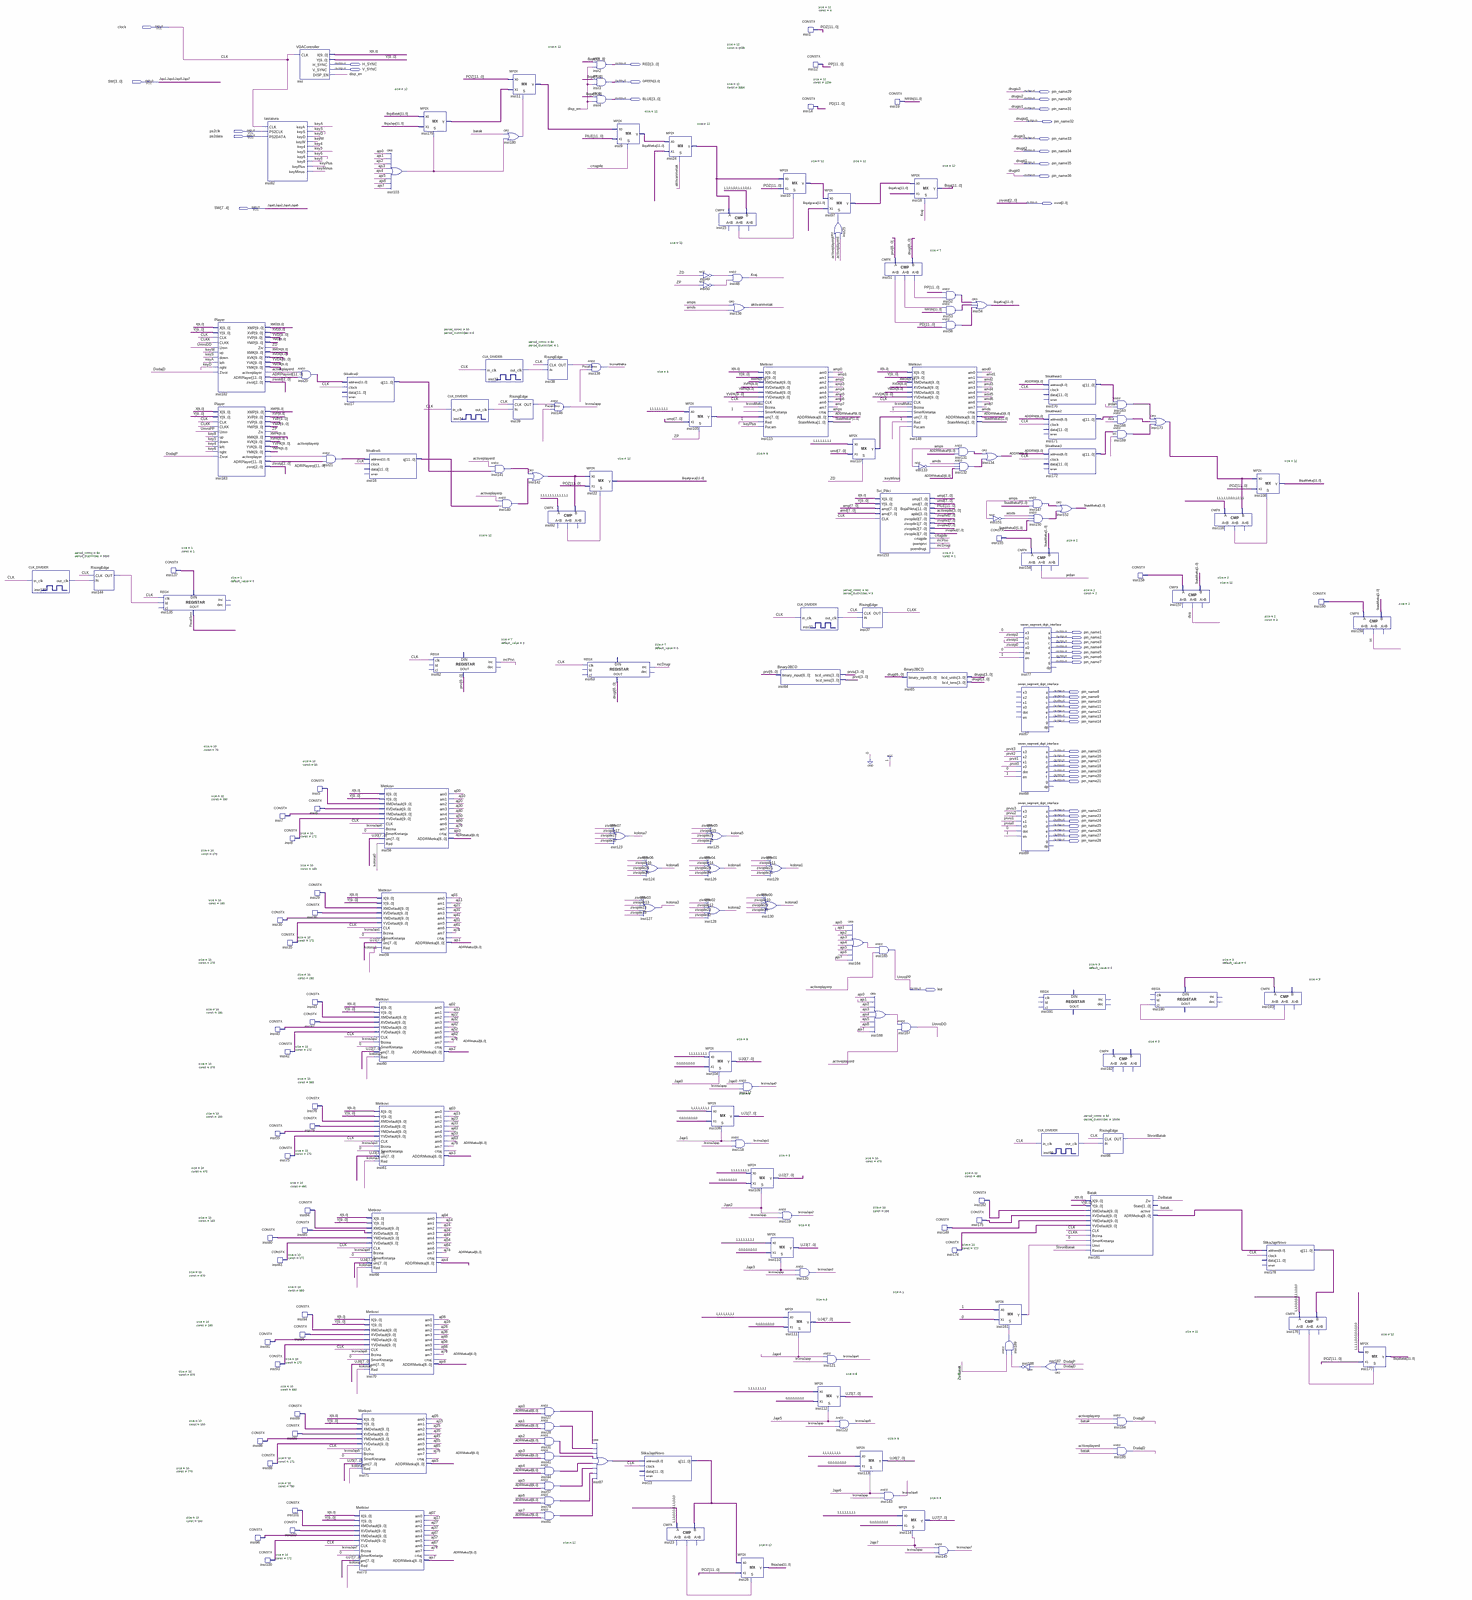
[diagram p0: schematic sheet, whole]
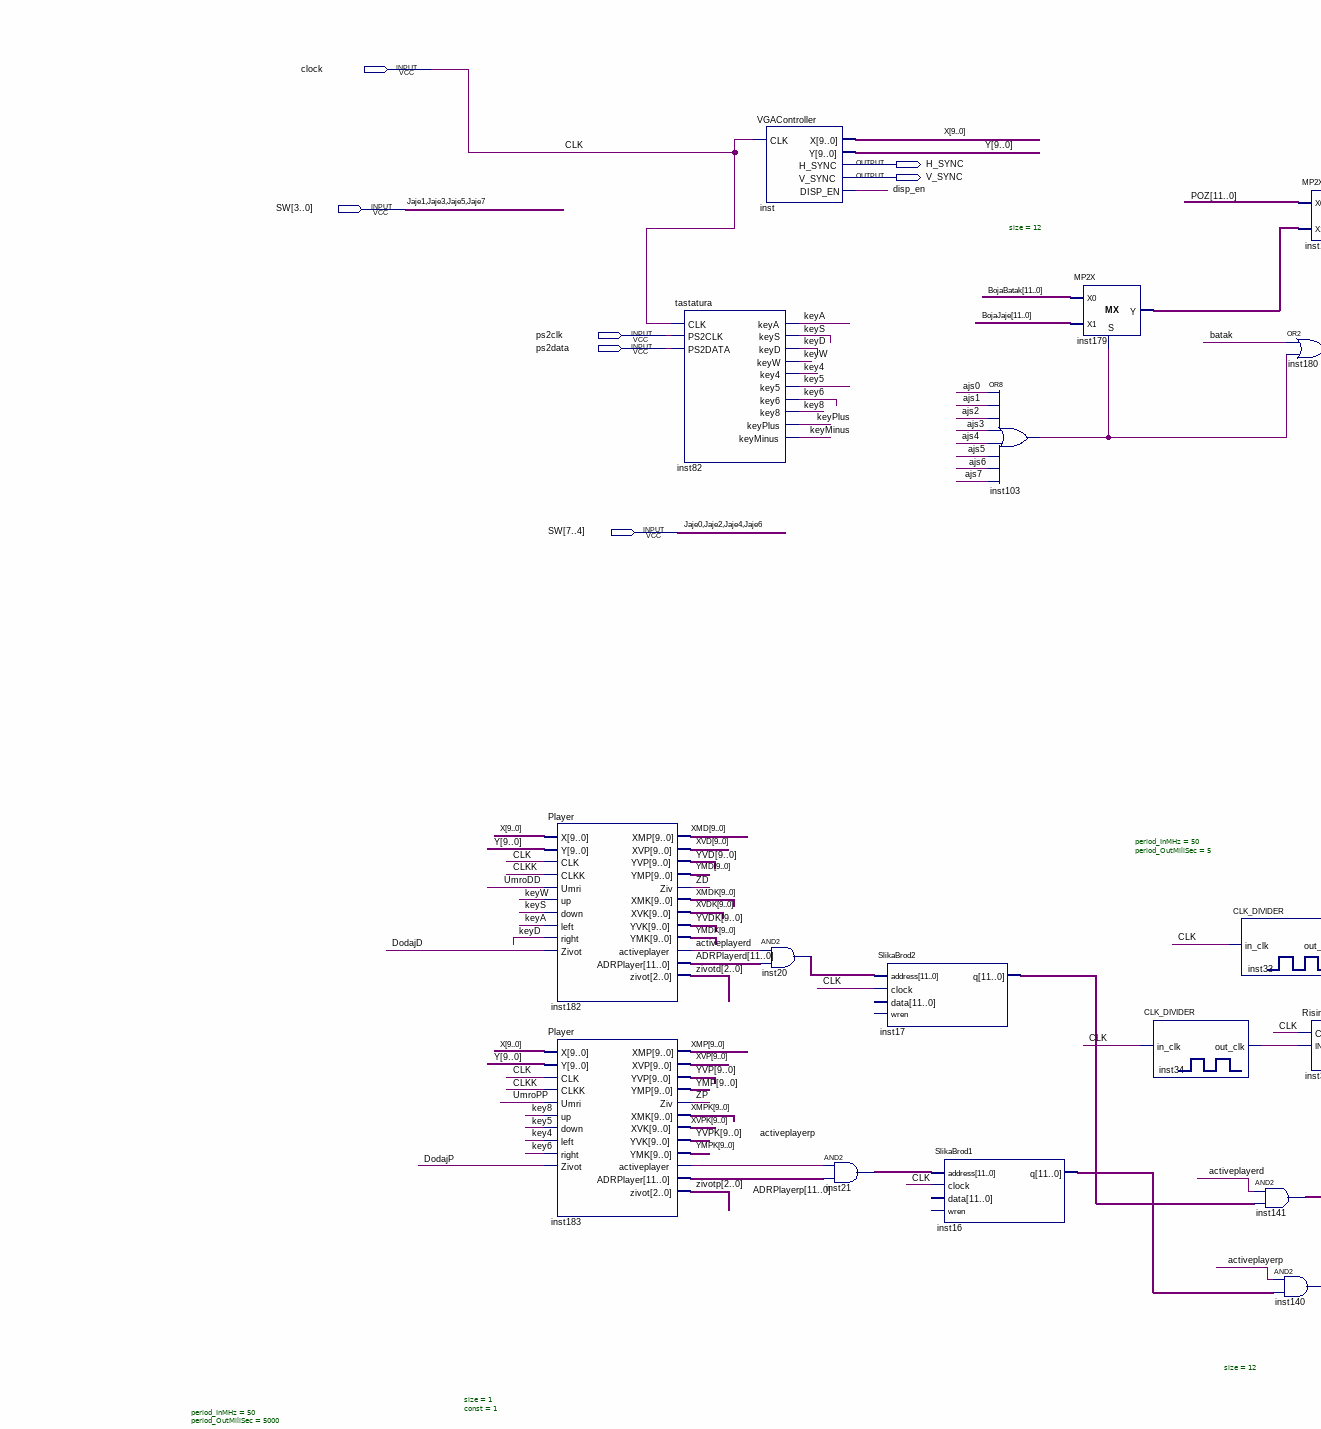
[diagram p1: schematic sheet, upper left part]
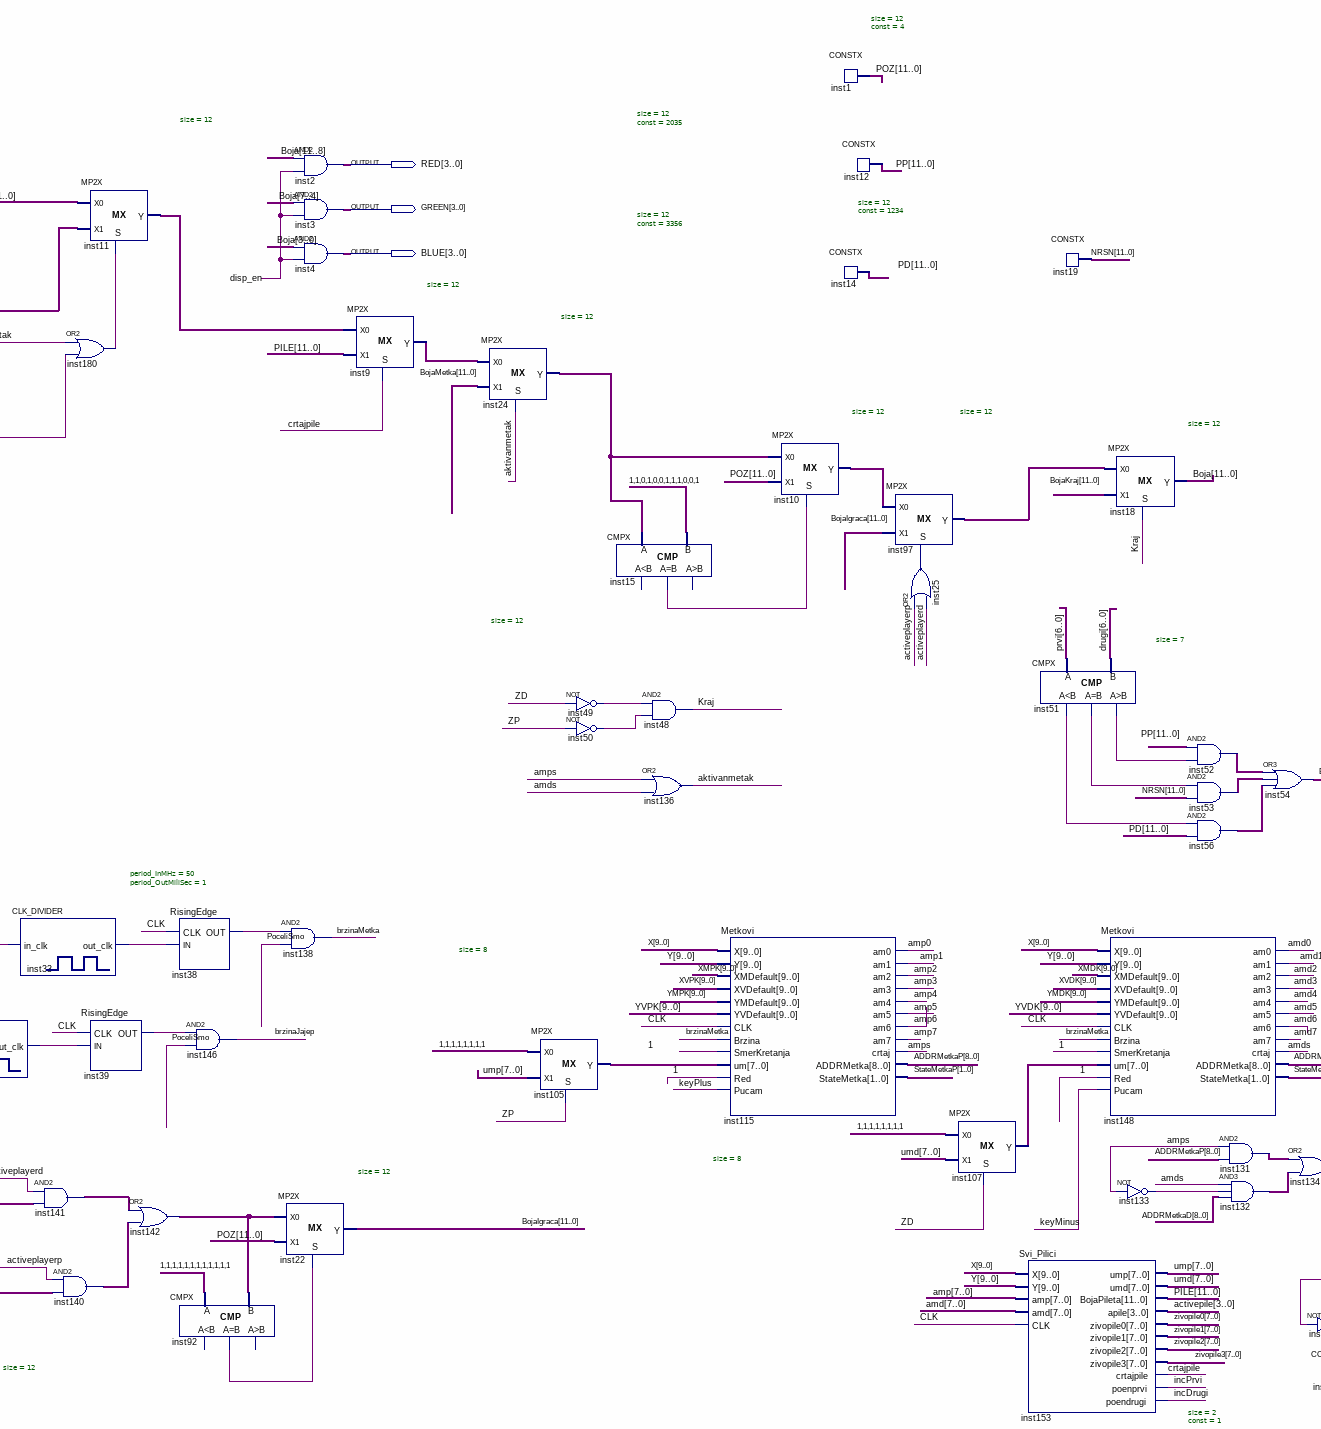
[diagram p2: schematic sheet, upper centre part]
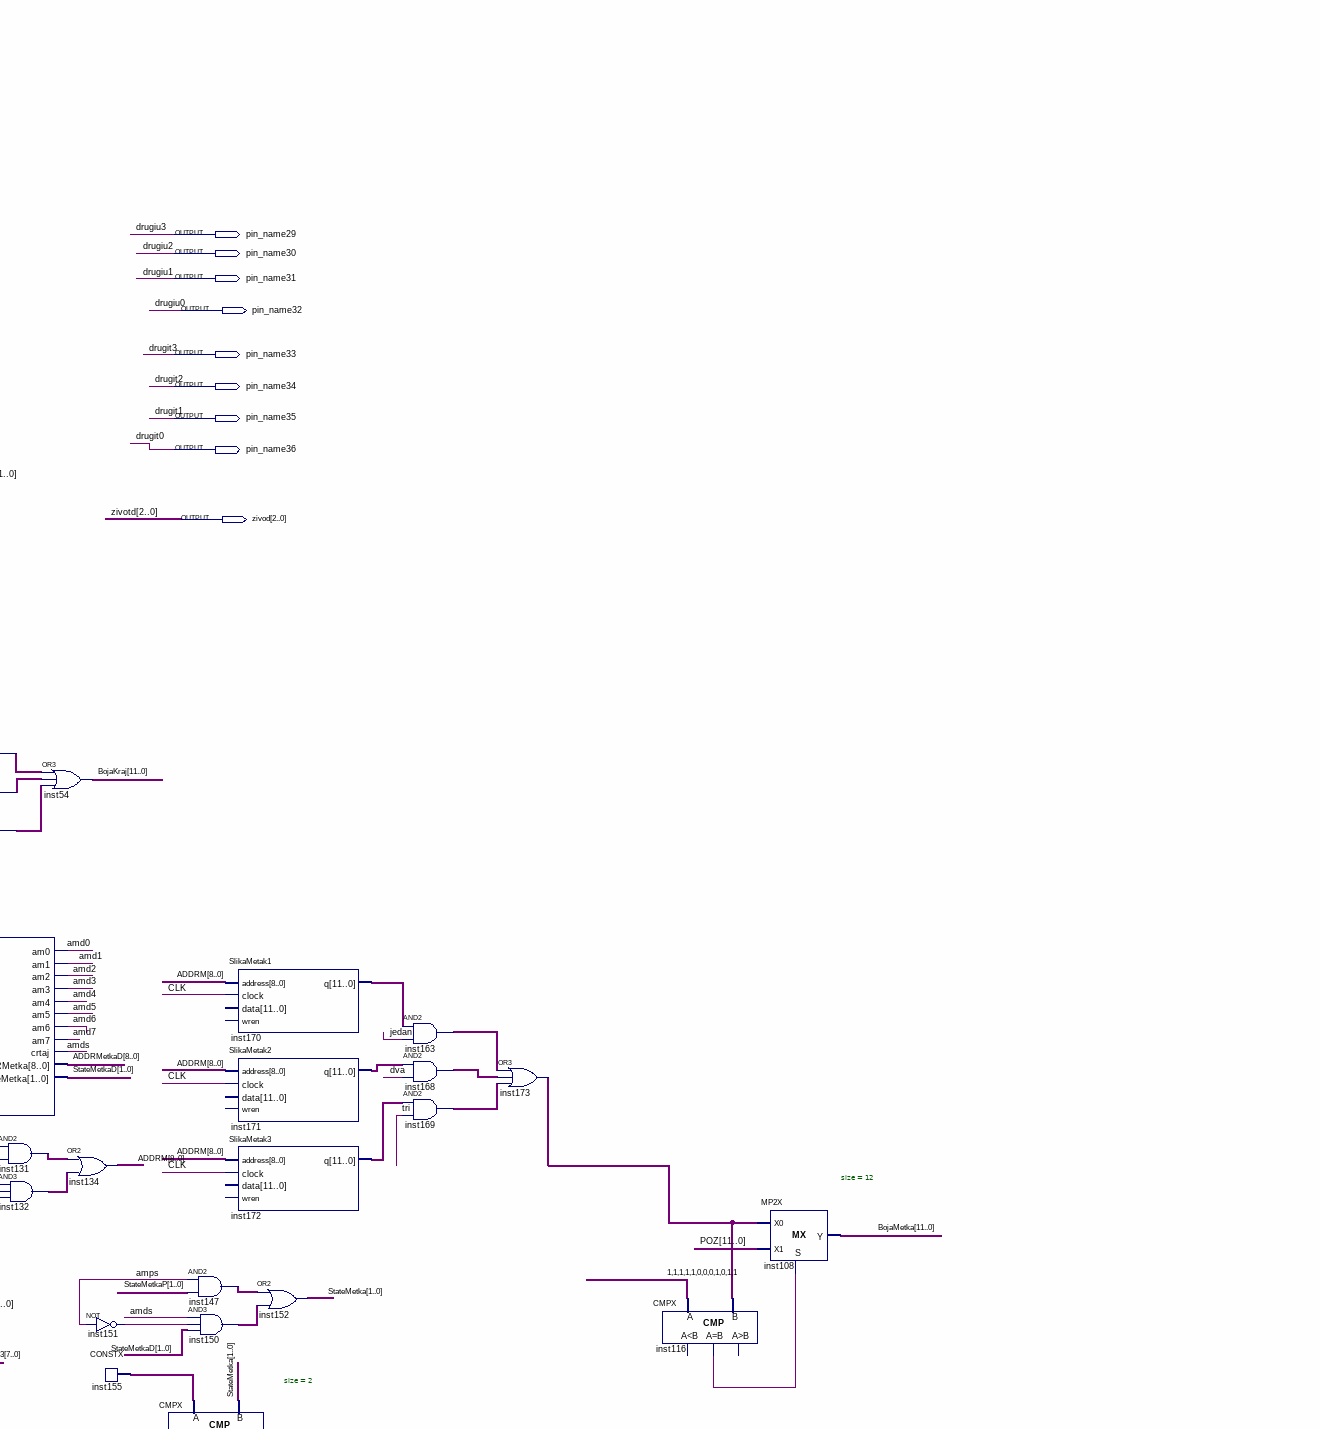
[diagram p3: schematic sheet, upper right part]
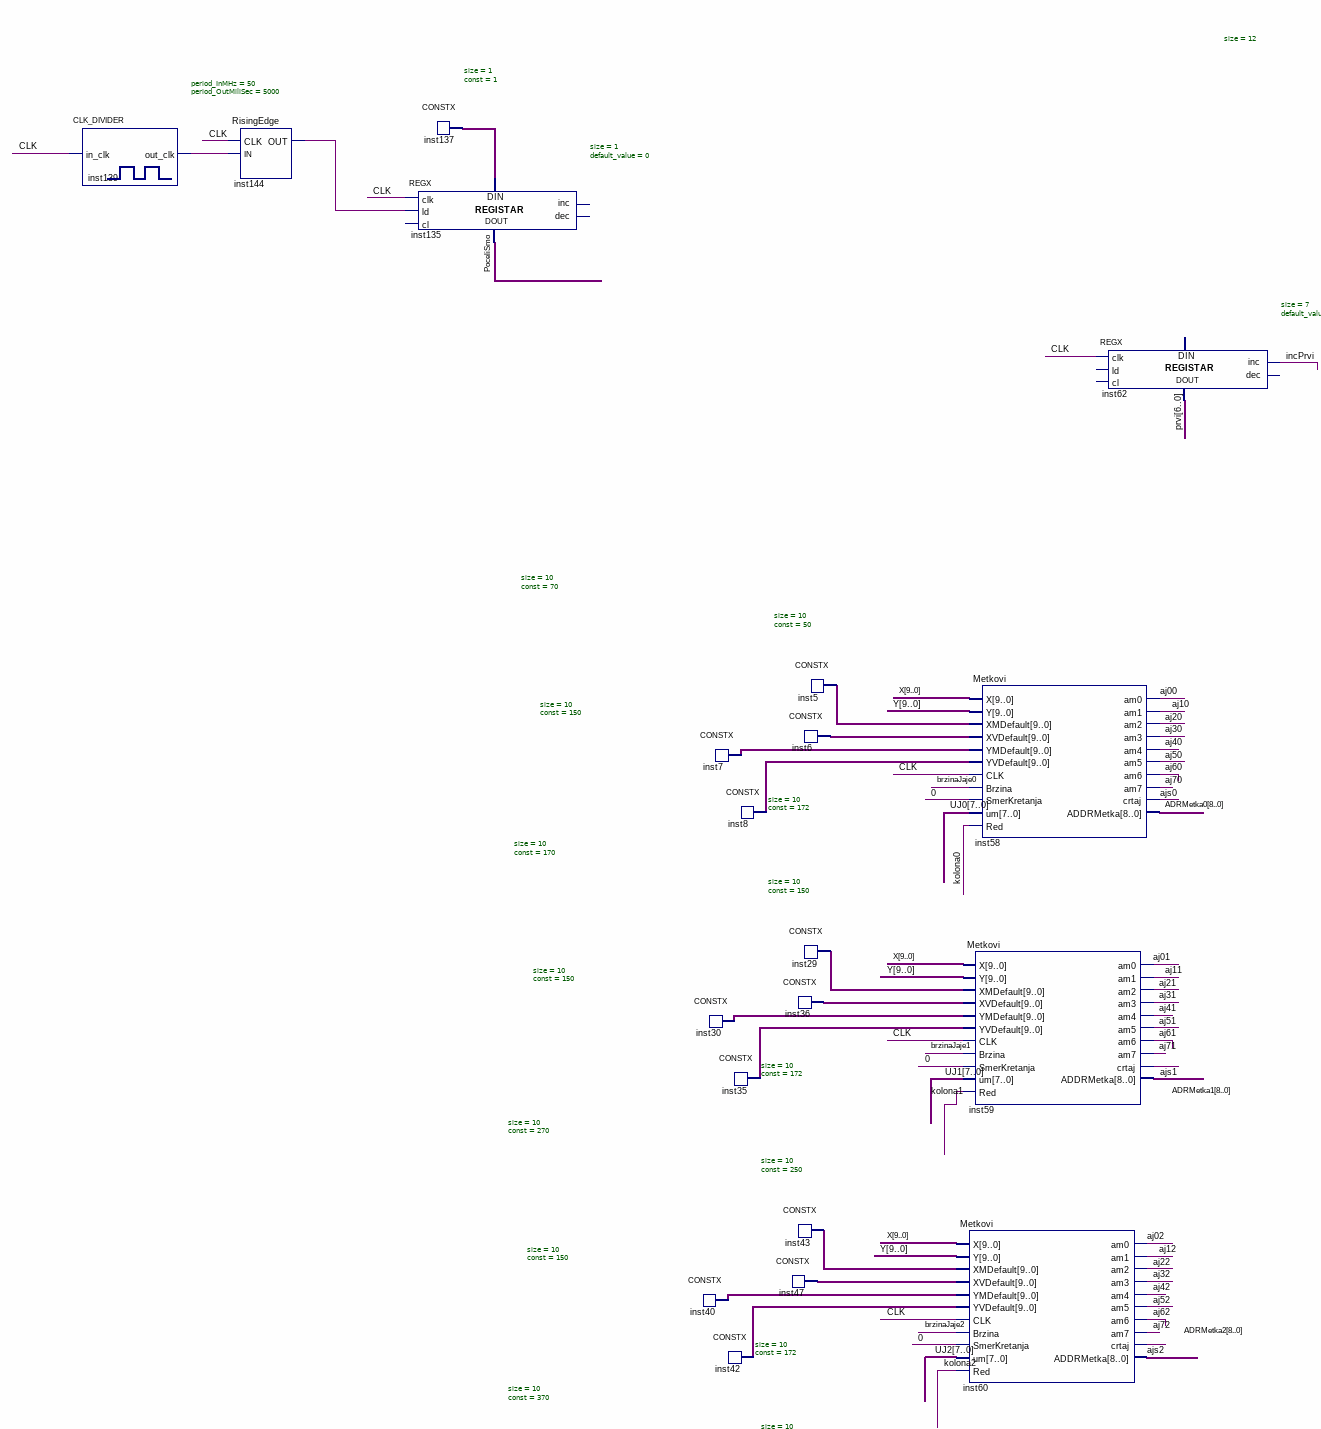
[diagram p4: schematic sheet, middle left part]
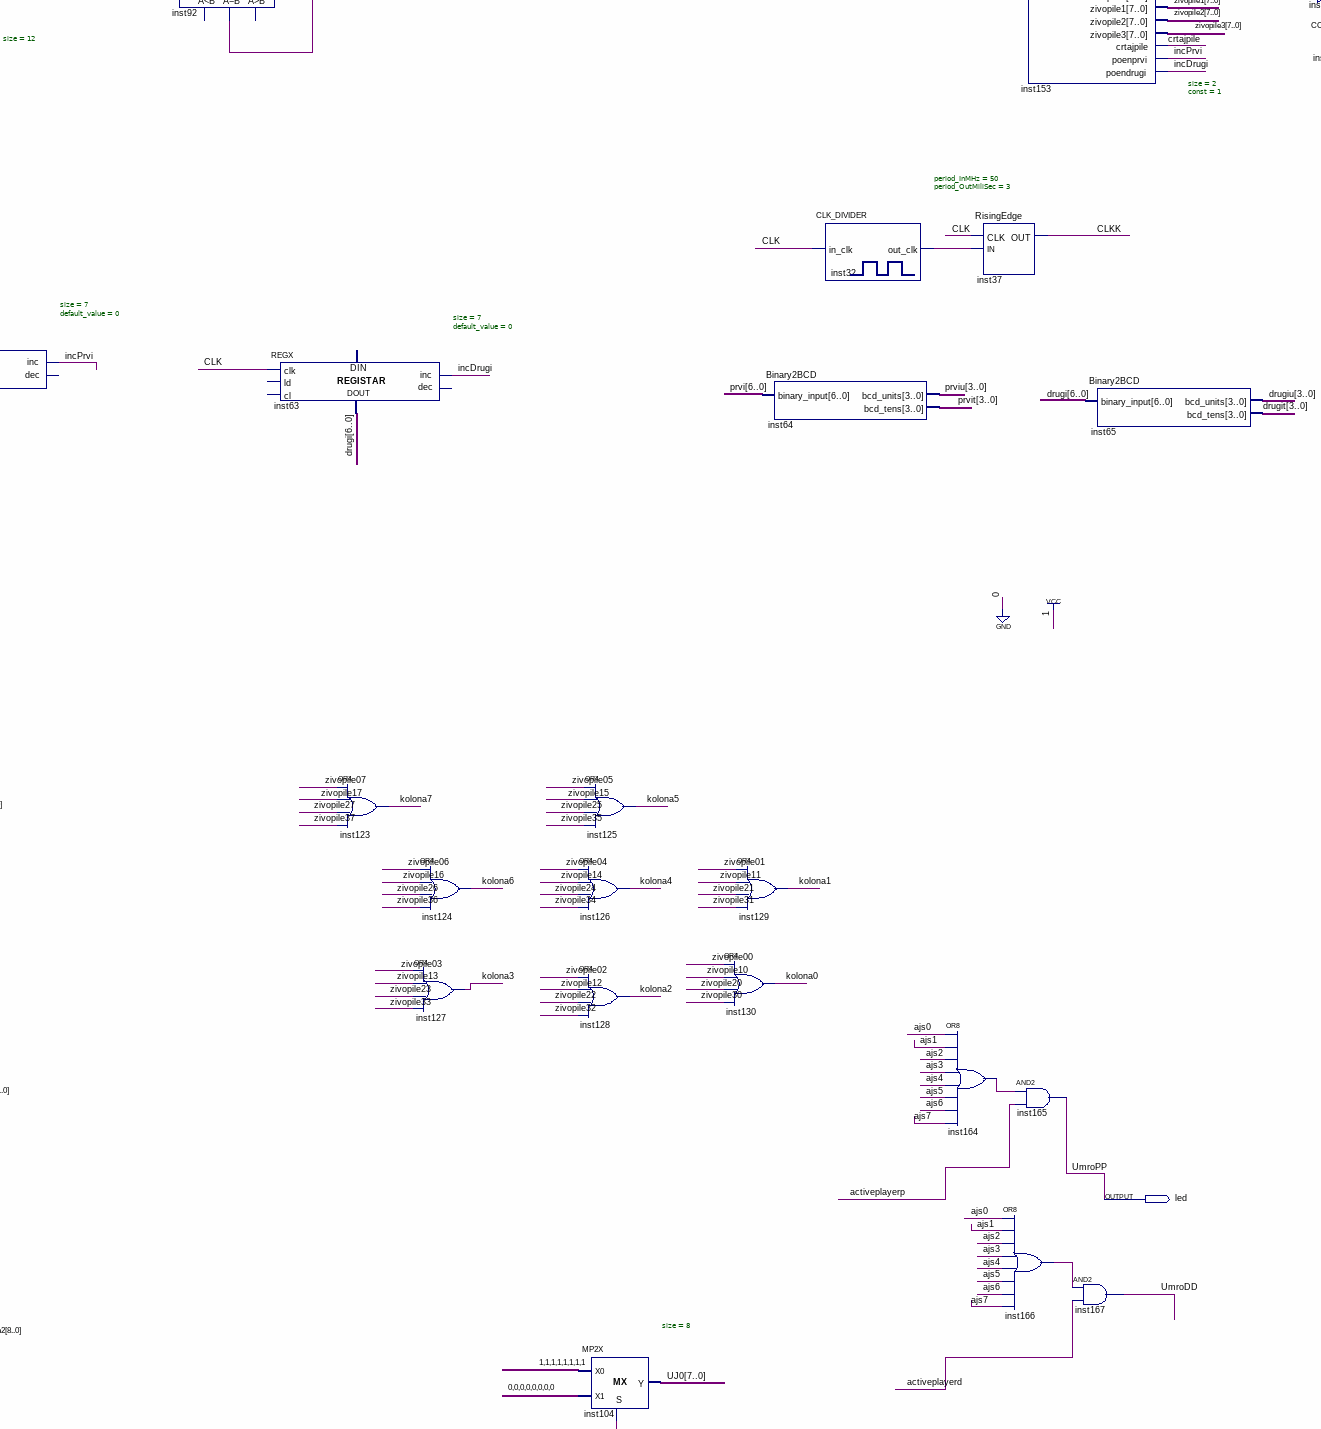
[diagram p5: schematic sheet, middle centre part]
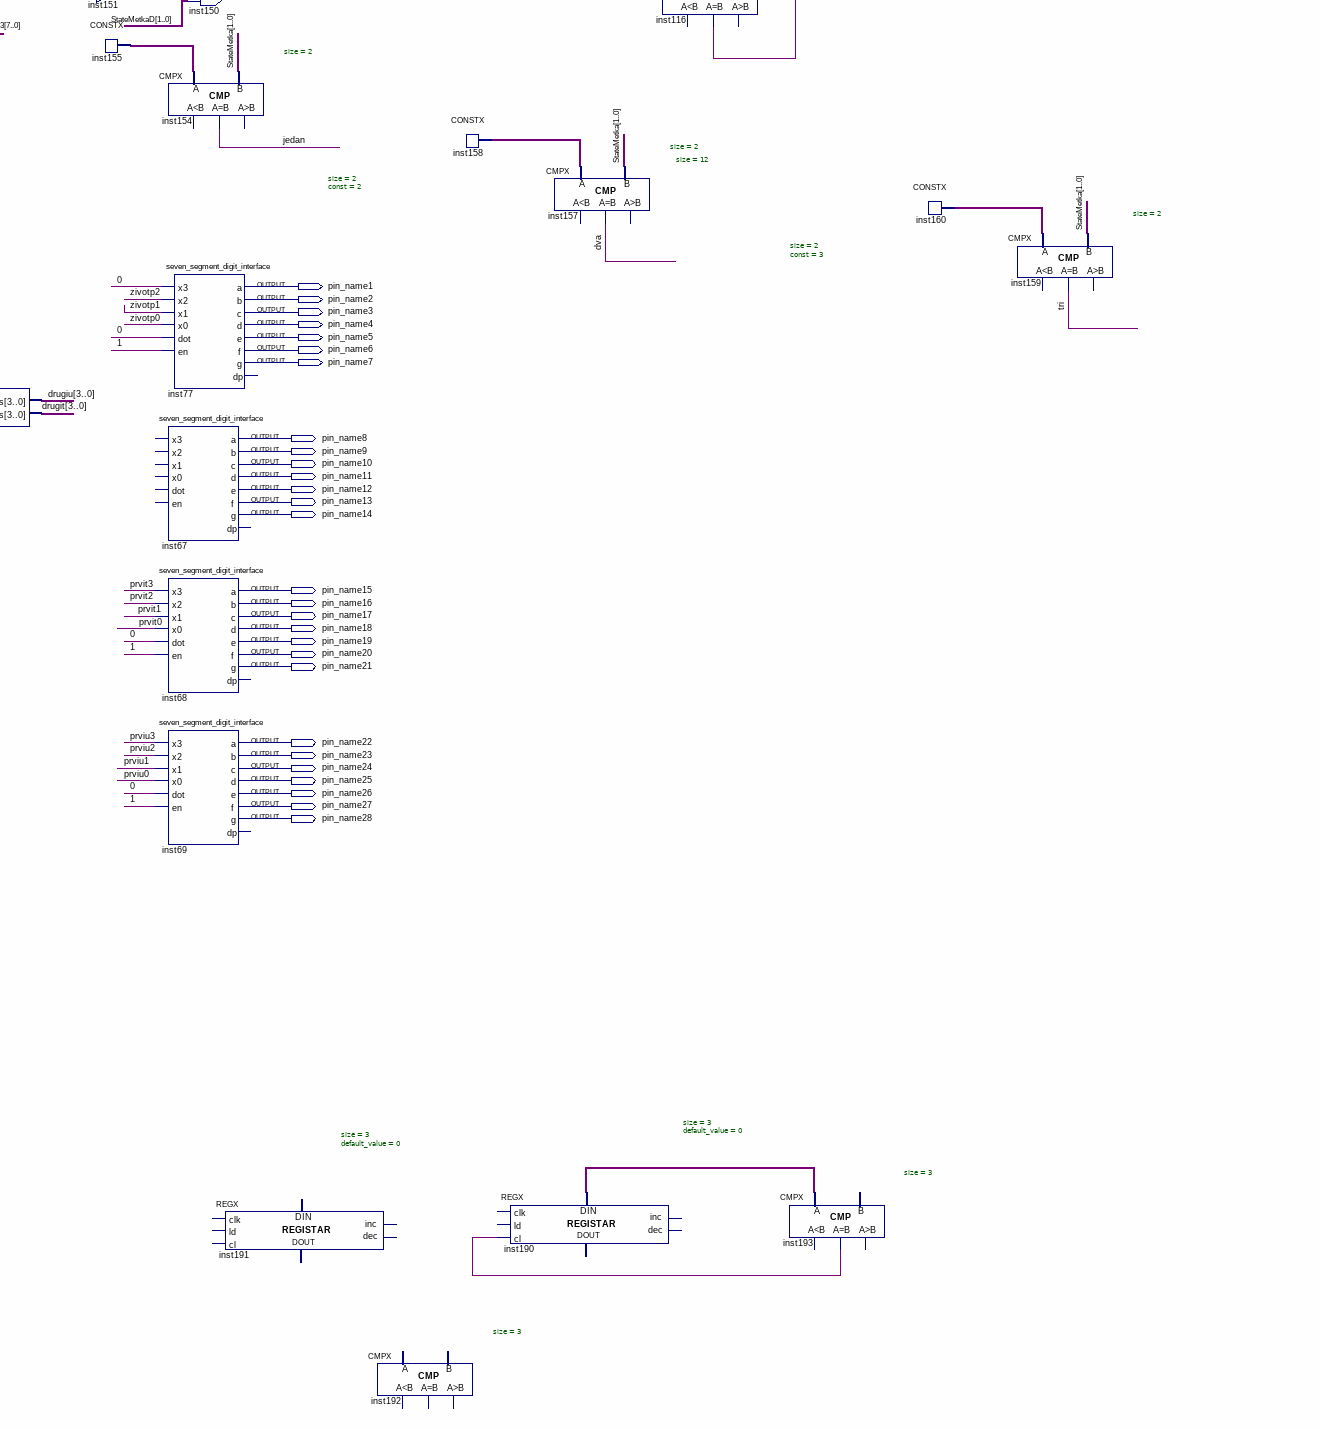
[diagram p6: schematic sheet, middle right part]
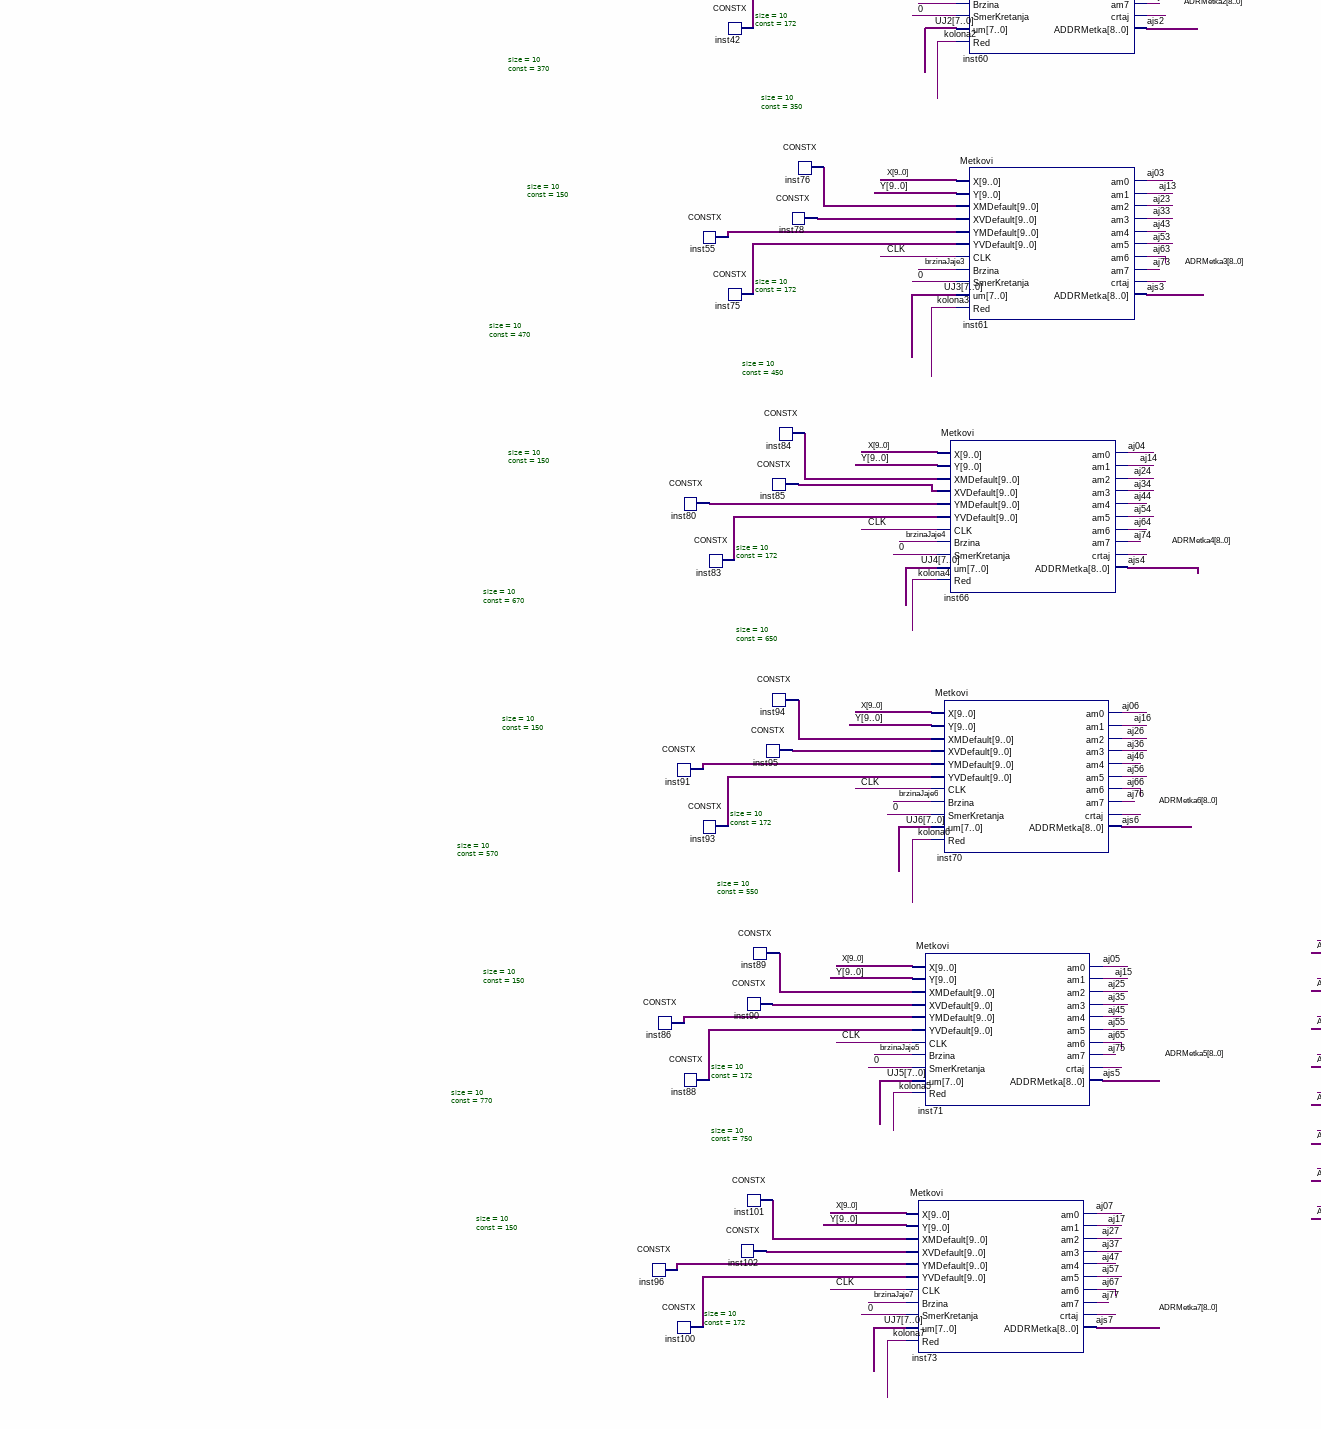
[diagram p7: schematic sheet, lower left part]
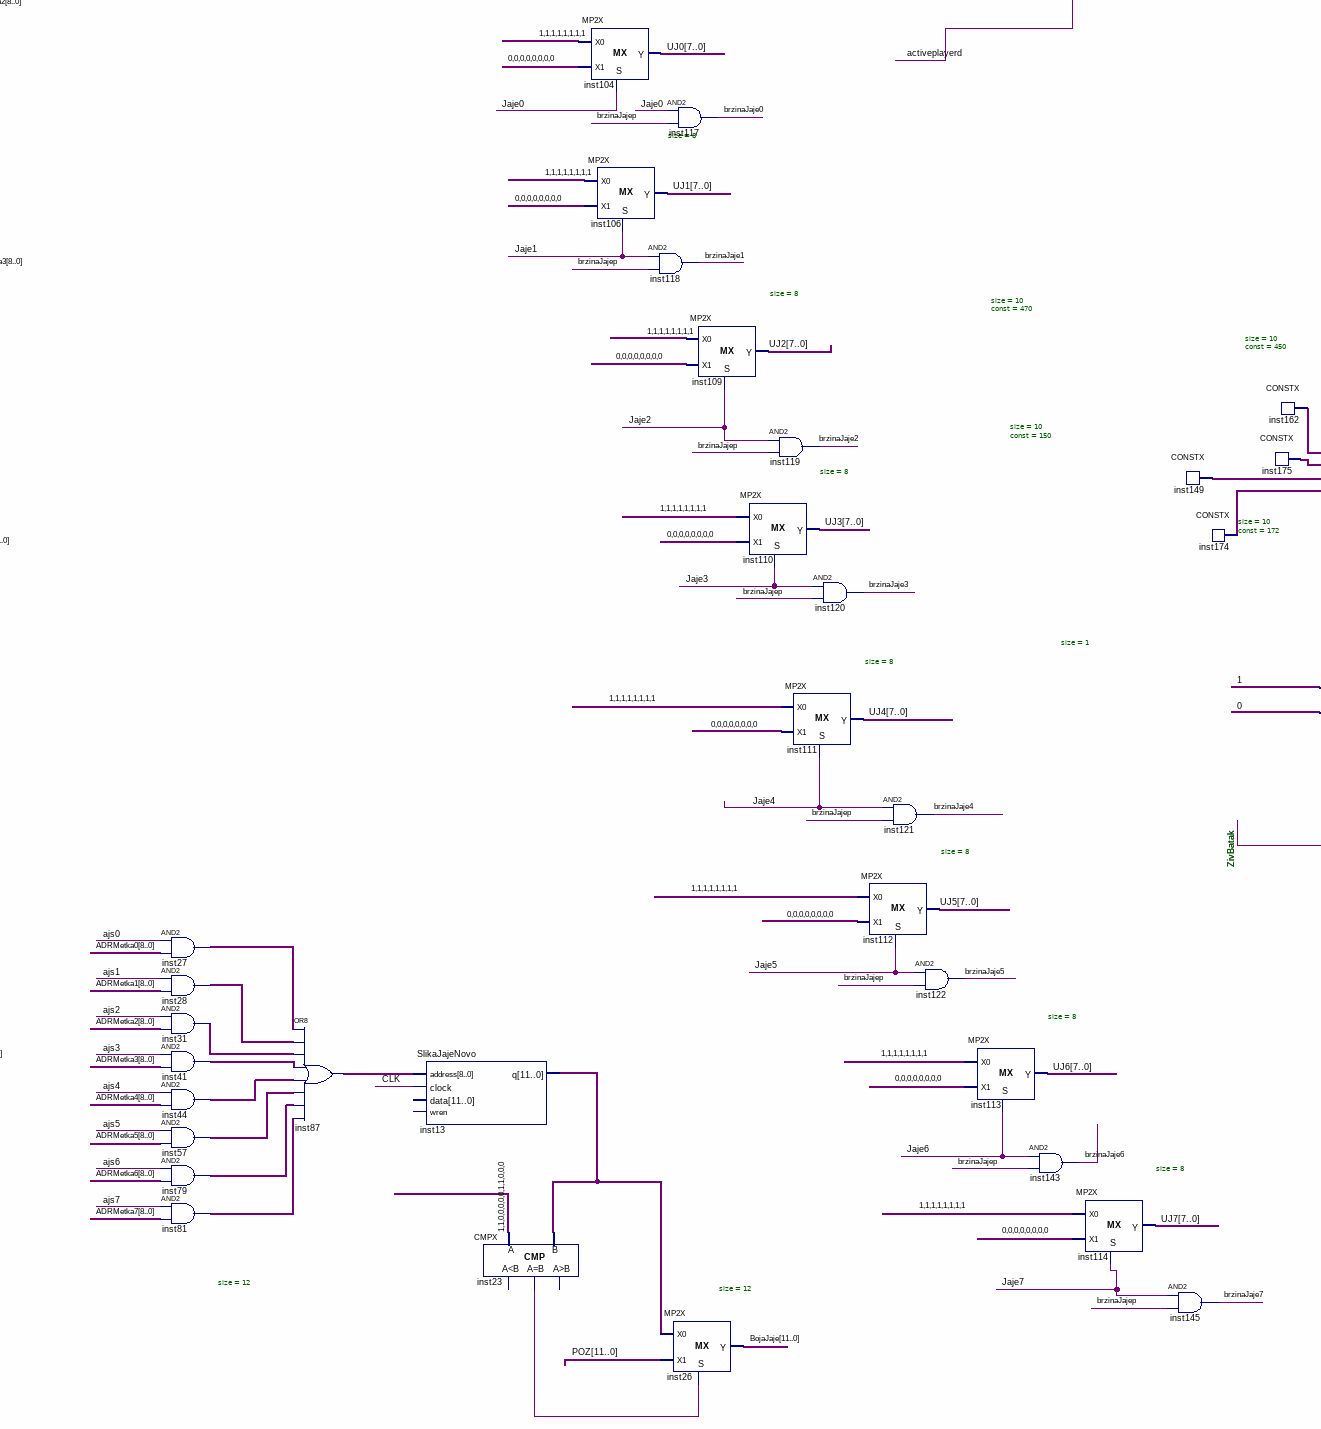
[diagram p8: schematic sheet, lower centre part]
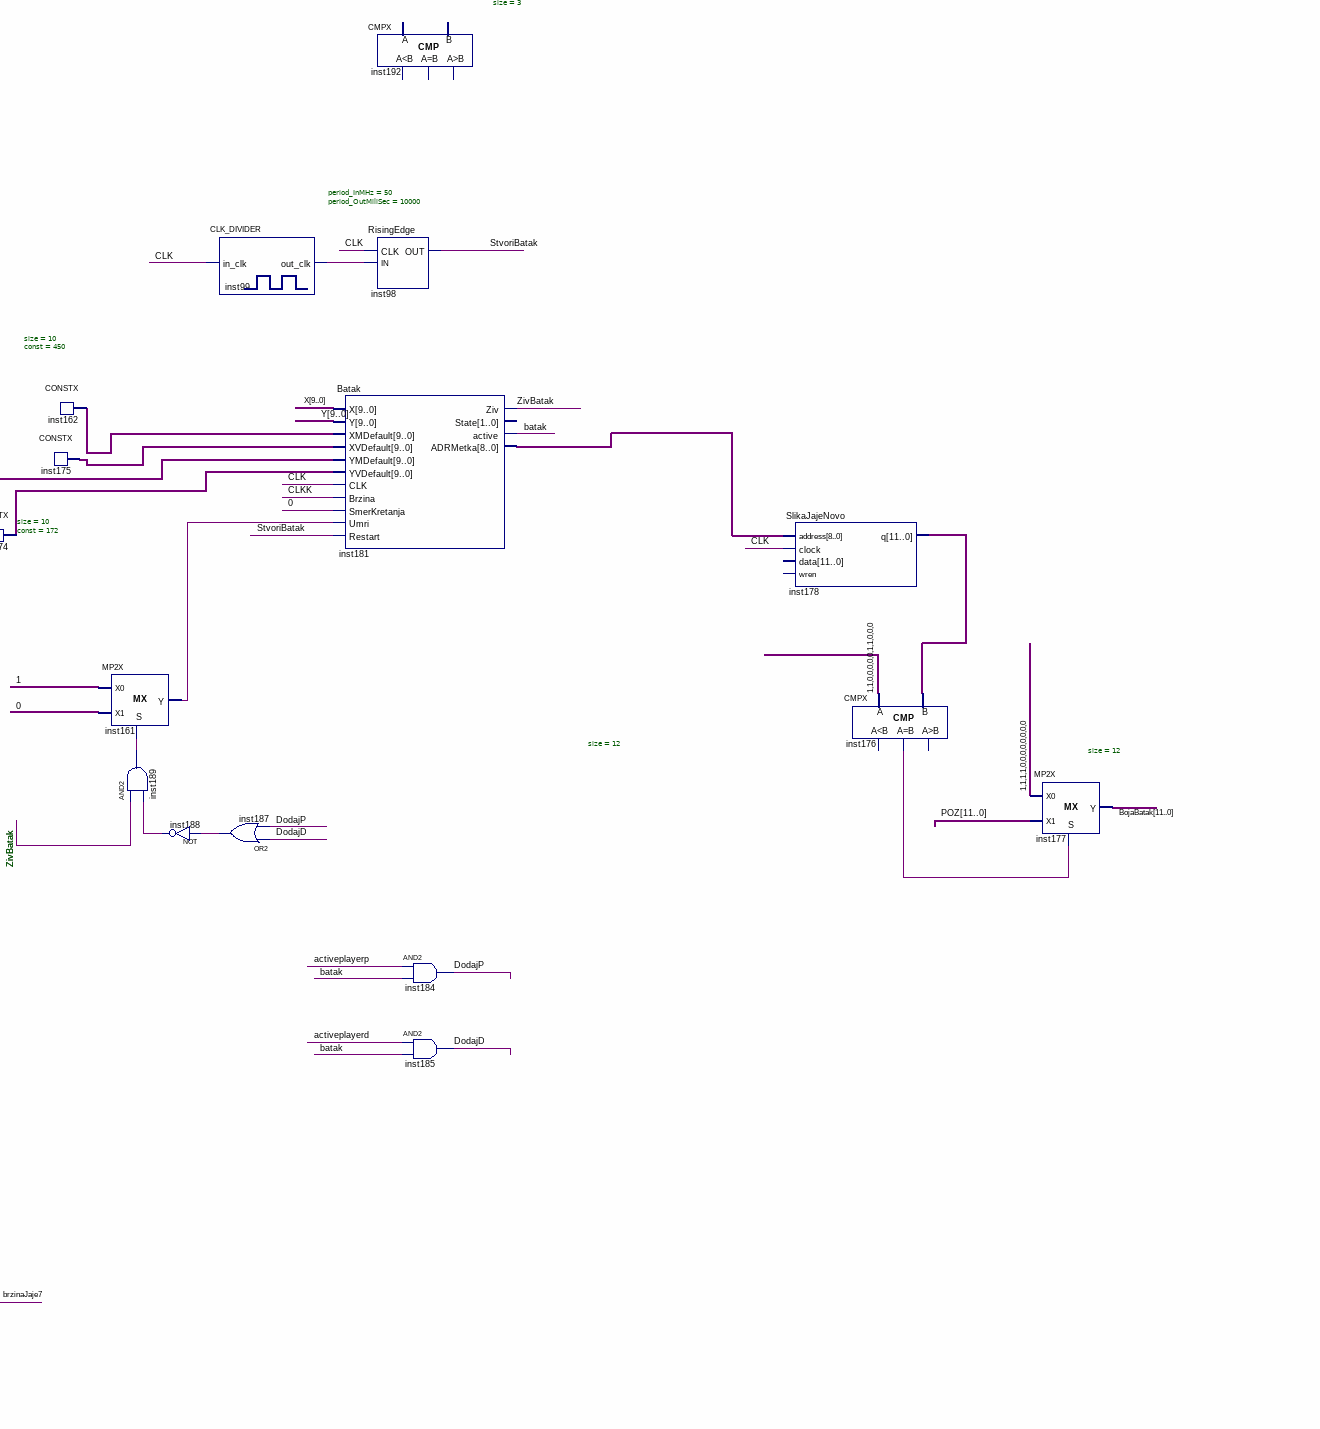
[diagram p9: schematic sheet, lower right part]
// Quartus schematic GlavnaSema.bdf as structural Verilog: 188 symbols, 48 pins
module GlavnaSema (
  input  clock,
  input  [7:0] SW,
  input  ps2clk,
  input  ps2data,
  output H_SYNC,
  output [3:0] RED,
  output V_SYNC,
  output [3:0] GREEN,
  output pin_name29,
  output [3:0] BLUE,
  output pin_name30,
  output pin_name31,
  output pin_name32,
  output pin_name33,
  output pin_name34,
  output pin_name35,
  output pin_name36,
  output [2:0] zivod,
  output pin_name1,
  output pin_name2,
  output pin_name3,
  output pin_name4,
  output pin_name5,
  output pin_name6,
  output pin_name7,
  output pin_name8,
  output pin_name9,
  output pin_name10,
  output pin_name11,
  output pin_name12,
  output pin_name13,
  output pin_name14,
  output pin_name15,
  output pin_name16,
  output pin_name17,
  output pin_name18,
  output pin_name19,
  output pin_name20,
  output pin_name21,
  output pin_name22,
  output pin_name23,
  output pin_name24,
  output pin_name25,
  output pin_name26,
  output pin_name27,
  output pin_name28,
  output led
);

  wire activeplayerd, activeplayerp, aj00, aj01, aj02, aj03, aj04, aj05, aj06, aj07, aj10, aj11, aj12, aj13,
       aj14, aj15, aj16, aj17, aj20, aj21, aj22, aj23, aj24, aj25, aj26, aj27, aj30, aj31, aj32, aj33, aj34,
       aj35, aj36, aj37, aj40, aj41, aj42, aj43, aj44, aj45, aj46, aj47, aj50, aj51, aj52, aj53, aj54, aj55,
       aj56, aj57, aj60, aj61, aj62, aj63, aj64, aj65, aj66, aj67, aj70, aj71, aj72, aj73, aj74, aj75, aj76,
       aj77, ajs0, ajs1, ajs2, ajs3, ajs4, ajs5, ajs6, ajs7, aktivanmetak, amds, amps, batak, brzinaJaje0,
       brzinaJaje1, brzinaJaje2, brzinaJaje3, brzinaJaje4, brzinaJaje5, brzinaJaje6, brzinaJaje7,
       brzinaJajep, brzinaMetka, CLKK, crtajpile, disp_en, DodajD, DodajP, dva, incDrugi, incPrvi, inst15_eq,
       inst23_eq, inst25_out, inst32_out_clk, inst33_out_clk, inst34_out_clk, inst38_out, inst39_out,
       inst49_out, inst50_out, inst51_eq, inst51_gr, inst51_ls, inst92_eq, inst99_out_clk, inst103_out,
       inst116_eq, inst133_out, inst137_data, inst139_out_clk, inst144_out, inst151_out, inst161_y,
       inst164_out, inst166_out, inst176_eq, inst180_out, inst187_out, inst188_out, inst189_out, inst193_eq,
       jedan, key4, key5, key6, key8, keyA, keyD, keyMinus, keyPlus, keyS, keyW, kolona0, kolona1, kolona2,
       kolona3, kolona4, kolona5, kolona6, kolona7, Kraj, PoceliSmo, StvoriBatak, \tri , UmroDD, ZD,
       ZivBatak, ZP;
  wire [1:0] inst147_out, inst150_out, inst155_data, inst158_data, inst160_data, StateMetka, StateMetkaD,
       StateMetkaP;
  wire [2:0] undriven, zivotp;
  wire [3:0] activepile, prvit, prviu;
  wire [6:0] drugi, prvi;
  wire [7:0] amd, amp, inst105_y, inst107_y, UJ0, UJ1, UJ2, UJ3, UJ4, UJ5, UJ6, UJ7, umd, ump, zivopile0,
       zivopile1, zivopile2, zivopile3;
  wire [8:0] ADDRM, ADDRMetkaD, ADDRMetkaP, ADRMetka0, ADRMetka1, ADRMetka2, ADRMetka3, ADRMetka4, ADRMetka5,
       ADRMetka6, ADRMetka7, inst27_out, inst28_out, inst31_out, inst41_out, inst44_out, inst57_out,
       inst79_out, inst81_out, inst87_out, inst131_out, inst132_out, inst181_adrmetka;
  wire [9:0] inst5_data, inst6_data, inst7_data, inst8_data, inst29_data, inst30_data, inst35_data,
       inst36_data, inst40_data, inst42_data, inst43_data, inst47_data, inst55_data, inst75_data,
       inst76_data, inst78_data, inst80_data, inst83_data, inst84_data, inst85_data, inst86_data,
       inst88_data, inst89_data, inst90_data, inst91_data, inst93_data, inst94_data, inst95_data,
       inst96_data, inst100_data, inst101_data, inst102_data, inst149_data, inst162_data, inst174_data,
       inst175_data, X, XMD, XMDK, XMP, XMPK, XVD, XVDK, XVP, XVPK, Y, YMD, YMDK, YMP, YMPK, YVD, YVDK, YVP,
       YVPK;
  wire [11:0] ADRPlayerd, ADRPlayerp, Boja, BojaBatak, BojaIgraca, BojaJaje, BojaKraj, BojaMetka, inst9_y,
       inst10_y, inst11_y, inst13_q, inst16_q, inst17_q, inst20_out, inst21_out, inst24_y, inst52_out,
       inst53_out, inst56_out, inst97_y, inst140_out, inst141_out, inst142_out, inst163_out, inst168_out,
       inst169_out, inst170_q, inst171_q, inst172_q, inst173_out, inst178_q, inst179_y, NRSN, PD, PILE, POZ,
       PP;

  CLK_DIVIDER #(.period_InMHz(50), .period_OutMiliSec(5000)) inst139 (.in_clk(clock), .out_clk(inst139_out_clk));
  RisingEdge inst144 (.CLK(clock), .IN(inst139_out_clk), .OUT(inst144_out));
  CONSTX #(.size(1), .\const (1)) inst137 (.data(inst137_data));
  REGX #(.size(1), .default_value(0)) inst135 (
    .clk(clock), .ld(inst144_out), .data_in(inst137_data), .data_out(PoceliSmo));  // open: cl, inc, dec
  Player inst182 (
    .X(X), .Y(Y), .CLK(clock), .CLKK(CLKK), .Umri(UmroDD), .up(keyW), .down(keyS), .left(keyA), .right(keyD),
    .Zivot(DodajD), .XMP(XMD), .XVP(XVD), .YVP(YVD), .YMP(YMD), .Ziv(ZD), .XMK(XMDK), .XVK(XVDK), .YVK(YVDK),
    .YMK(YMDK), .activeplayer(activeplayerd), .ADRPlayer(ADRPlayerd), .zivot(zivod));
  Player inst183 (
    .X(X), .Y(Y), .CLK(clock), .CLKK(CLKK), .Umri(led), .up(key8), .down(key5), .left(key4), .right(key6),
    .Zivot(DodajP), .XMP(XMP), .XVP(XVP), .YVP(YVP), .YMP(YMP), .Ziv(ZP), .XMK(XMPK), .XVK(XVPK), .YVK(YVPK),
    .YMK(YMPK), .activeplayer(activeplayerp), .ADRPlayer(ADRPlayerp), .zivot(zivotp));
  CONSTX #(.size(10), .\const (150)) inst86 (.data(inst86_data));
  CONSTX #(.size(10), .\const (150)) inst96 (.data(inst96_data));
  tastatura inst82 (
    .CLK(clock), .PS2CLK(ps2clk), .PS2DATA(ps2data), .keyA(keyA), .keyS(keyS), .keyD(keyD), .keyW(keyW),
    .key4(key4), .key5(key5), .key6(key6), .key8(key8), .keyPlus(keyPlus), .keyMinus(keyMinus));
  CONSTX #(.size(10), .\const (150)) inst7 (.data(inst7_data));
  CONSTX #(.size(10), .\const (150)) inst30 (.data(inst30_data));
  CONSTX #(.size(10), .\const (150)) inst40 (.data(inst40_data));
  CONSTX #(.size(10), .\const (150)) inst55 (.data(inst55_data));
  CONSTX #(.size(10), .\const (150)) inst80 (.data(inst80_data));
  CONSTX #(.size(10), .\const (172)) inst83 (.data(inst83_data));
  CONSTX #(.size(10), .\const (150)) inst91 (.data(inst91_data));
  CONSTX #(.size(10), .\const (172)) inst93 (.data(inst93_data));
  CONSTX #(.size(10), .\const (172)) inst88 (.data(inst88_data));
  CONSTX #(.size(10), .\const (172)) inst100 (.data(inst100_data));
  VGAController inst (.CLK(clock), .X(X), .Y(Y), .H_SYNC(H_SYNC), .V_SYNC(V_SYNC), .DISP_EN(disp_en));
  CONSTX #(.size(10), .\const (172)) inst8 (.data(inst8_data));
  CONSTX #(.size(10), .\const (172)) inst35 (.data(inst35_data));
  CONSTX #(.size(10), .\const (172)) inst42 (.data(inst42_data));
  CONSTX #(.size(10), .\const (172)) inst75 (.data(inst75_data));
  CONSTX #(.size(10), .\const (470)) inst85 (.data(inst85_data));
  CONSTX #(.size(10), .\const (650)) inst94 (.data(inst94_data));
  CONSTX #(.size(10), .\const (670)) inst95 (.data(inst95_data));
  CONSTX #(.size(10), .\const (550)) inst89 (.data(inst89_data));
  CONSTX #(.size(10), .\const (570)) inst90 (.data(inst90_data));
  CONSTX #(.size(10), .\const (750)) inst101 (.data(inst101_data));
  CONSTX #(.size(10), .\const (770)) inst102 (.data(inst102_data));
  assign inst20_out = {12{activeplayerd}} & ADRPlayerd;  // AND2 inst20, 12 bits wide
  CONSTX #(.size(10), .\const (50)) inst5 (.data(inst5_data));
  CONSTX #(.size(10), .\const (70)) inst6 (.data(inst6_data));
  CONSTX #(.size(10), .\const (150)) inst29 (.data(inst29_data));
  CONSTX #(.size(10), .\const (170)) inst36 (.data(inst36_data));
  CONSTX #(.size(10), .\const (250)) inst43 (.data(inst43_data));
  CONSTX #(.size(10), .\const (270)) inst47 (.data(inst47_data));
  CONSTX #(.size(10), .\const (350)) inst76 (.data(inst76_data));
  CONSTX #(.size(10), .\const (370)) inst78 (.data(inst78_data));
  CONSTX #(.size(10), .\const (450)) inst84 (.data(inst84_data));
  assign inst21_out = {12{activeplayerp}} & ADRPlayerp;  // AND2 inst21, 12 bits wide
  SlikaBrod2 inst17 (.address(inst20_out), .clock(clock), .q(inst17_q));  // open: data, wren
  Metkovi inst73 (
    .X(X), .Y(Y), .XMDefault(inst101_data), .XVDefault(inst102_data), .YMDefault(inst96_data),
    .YVDefault(inst100_data), .CLK(clock), .Brzina(brzinaJaje7), .SmerKretanja(1'b0), .um(UJ7),
    .Red(kolona7), .am0(aj07), .am1(aj17), .am2(aj27), .am3(aj37), .am4(aj47), .am5(aj57), .am6(aj67),
    .am7(aj77), .crtaj(ajs7), .ADDRMetka(ADRMetka7));
  SlikaBrod1 inst16 (.address(inst21_out), .clock(clock), .q(inst16_q));  // open: data, wren
  Metkovi inst60 (
    .X(X), .Y(Y), .XMDefault(inst43_data), .XVDefault(inst47_data), .YMDefault(inst40_data),
    .YVDefault(inst42_data), .CLK(clock), .Brzina(brzinaJaje2), .SmerKretanja(1'b0), .um(UJ2), .Red(kolona2),
    .am0(aj02), .am1(aj12), .am2(aj22), .am3(aj32), .am4(aj42), .am5(aj52), .am6(aj62), .am7(aj72),
    .crtaj(ajs2), .ADDRMetka(ADRMetka2));
  Metkovi inst61 (
    .X(X), .Y(Y), .XMDefault(inst76_data), .XVDefault(inst78_data), .YMDefault(inst55_data),
    .YVDefault(inst75_data), .CLK(clock), .Brzina(brzinaJaje3), .SmerKretanja(1'b0), .um(UJ3), .Red(kolona3),
    .am0(aj03), .am1(aj13), .am2(aj23), .am3(aj33), .am4(aj43), .am5(aj53), .am6(aj63), .am7(aj73),
    .crtaj(ajs3), .ADDRMetka(ADRMetka3));
  Metkovi inst66 (
    .X(X), .Y(Y), .XMDefault(inst84_data), .XVDefault(inst85_data), .YMDefault(inst80_data),
    .YVDefault(inst83_data), .CLK(clock), .Brzina(brzinaJaje4), .SmerKretanja(1'b0), .um(UJ4), .Red(kolona4),
    .am0(aj04), .am1(aj14), .am2(aj24), .am3(aj34), .am4(aj44), .am5(aj54), .am6(aj64), .am7(aj74),
    .crtaj(ajs4), .ADDRMetka(ADRMetka4));
  Metkovi inst70 (
    .X(X), .Y(Y), .XMDefault(inst94_data), .XVDefault(inst95_data), .YMDefault(inst91_data),
    .YVDefault(inst93_data), .CLK(clock), .Brzina(brzinaJaje6), .SmerKretanja(1'b0), .um(UJ6), .Red(kolona6),
    .am0(aj06), .am1(aj16), .am2(aj26), .am3(aj36), .am4(aj46), .am5(aj56), .am6(aj66), .am7(aj76),
    .crtaj(ajs6), .ADDRMetka(ADRMetka6));
  Metkovi inst71 (
    .X(X), .Y(Y), .XMDefault(inst89_data), .XVDefault(inst90_data), .YMDefault(inst86_data),
    .YVDefault(inst88_data), .CLK(clock), .Brzina(brzinaJaje5), .SmerKretanja(1'b0), .um(UJ5), .Red(kolona5),
    .am0(aj05), .am1(aj15), .am2(aj25), .am3(aj35), .am4(aj45), .am5(aj55), .am6(aj65), .am7(aj75),
    .crtaj(ajs5), .ADDRMetka(ADRMetka5));
  or inst103 (inst103_out, ajs0, ajs1, ajs2, ajs3, ajs4, ajs5, ajs6, ajs7);
  Metkovi inst58 (
    .X(X), .Y(Y), .XMDefault(inst5_data), .XVDefault(inst6_data), .YMDefault(inst7_data),
    .YVDefault(inst8_data), .CLK(clock), .Brzina(brzinaJaje0), .SmerKretanja(1'b0), .um(UJ0), .Red(kolona0),
    .am0(aj00), .am1(aj10), .am2(aj20), .am3(aj30), .am4(aj40), .am5(aj50), .am6(aj60), .am7(aj70),
    .crtaj(ajs0), .ADDRMetka(ADRMetka0));
  Metkovi inst59 (
    .X(X), .Y(Y), .XMDefault(inst29_data), .XVDefault(inst36_data), .YMDefault(inst30_data),
    .YVDefault(inst35_data), .CLK(clock), .Brzina(brzinaJaje1), .SmerKretanja(1'b0), .um(UJ1), .Red(kolona1),
    .am0(aj01), .am1(aj11), .am2(aj21), .am3(aj31), .am4(aj41), .am5(aj51), .am6(aj61), .am7(aj71),
    .crtaj(ajs1), .ADDRMetka(ADRMetka1));
  MP2X #(.size(12)) inst179 (.S(inst103_out), .X0(BojaBatak), .X1(BojaJaje), .Y(inst179_y));
  REGX #(.size(7), .default_value(0)) inst62 (
    .clk(clock), .inc(incPrvi), .data_out(prvi));  // open: ld, cl, dec, data_in
  CLK_DIVIDER #(.period_InMHz(50), .period_OutMiliSec(5)) inst34 (.in_clk(clock), .out_clk(inst34_out_clk));
  CLK_DIVIDER #(.period_InMHz(50), .period_OutMiliSec(1)) inst33 (.in_clk(clock), .out_clk(inst33_out_clk));
  assign inst141_out = {12{activeplayerd}} & inst17_q;  // AND2 inst141, 12 bits wide
  MP2X #(.size(12)) inst11 (.S(inst180_out), .X0(POZ), .X1(inst179_y), .Y(inst11_y));
  or inst180 (inst180_out, batak, inst103_out);
  RisingEdge inst39 (.CLK(clock), .IN(inst34_out_clk), .OUT(inst39_out));
  assign inst140_out = {12{activeplayerp}} & inst16_q;  // AND2 inst140, 12 bits wide
  assign inst142_out = inst141_out | inst140_out;  // OR2 inst142, 12 bits wide
  RisingEdge inst38 (.CLK(clock), .IN(inst33_out_clk), .OUT(inst38_out));
  and inst146 (brzinaJajep, inst39_out, PoceliSmo);
  CMPX #(.size(12)) inst92 (.A({12{1'b1}}), .B(inst142_out), .eq(inst92_eq));  // open: ls, gr
  assign inst27_out = {9{ajs0}} & ADRMetka0;  // AND2 inst27, 9 bits wide
  assign inst28_out = {9{ajs1}} & ADRMetka1;  // AND2 inst28, 9 bits wide
  assign inst31_out = {9{ajs2}} & ADRMetka2;  // AND2 inst31, 9 bits wide
  assign inst41_out = {9{ajs3}} & ADRMetka3;  // AND2 inst41, 9 bits wide
  assign inst44_out = {9{ajs4}} & ADRMetka4;  // AND2 inst44, 9 bits wide
  assign inst57_out = {9{ajs5}} & ADRMetka5;  // AND2 inst57, 9 bits wide
  assign inst79_out = {9{ajs6}} & ADRMetka6;  // AND2 inst79, 9 bits wide
  assign inst81_out = {9{ajs7}} & ADRMetka7;  // AND2 inst81, 9 bits wide
  assign RED = Boja[11:8] & {4{disp_en}};  // AND2 inst2, 4 bits wide
  assign GREEN = Boja[7:4] & {4{disp_en}};  // AND2 inst3, 4 bits wide
  assign BLUE = Boja[3:0] & {4{disp_en}};  // AND2 inst4, 4 bits wide
  and inst138 (brzinaMetka, inst38_out, PoceliSmo);
  MP2X #(.size(12)) inst22 (.S(inst92_eq), .X0(inst142_out), .X1(POZ), .Y(BojaIgraca));
  REGX #(.size(7), .default_value(0)) inst63 (
    .clk(clock), .inc(incDrugi), .data_out(drugi));  // open: ld, cl, dec, data_in
  assign inst87_out = inst27_out | inst28_out | inst31_out | inst41_out | inst44_out | inst57_out | inst79_out | inst81_out;  // OR8 inst87, 9 bits wide
  MP2X #(.size(12)) inst9 (.S(crtajpile), .X0(inst11_y), .X1(PILE), .Y(inst9_y));
  or inst123 (kolona7, zivopile0[7], zivopile1[7], zivopile2[7], zivopile3[7]);
  or inst124 (kolona6, zivopile0[6], zivopile1[6], zivopile2[6], zivopile3[6]);
  or inst127 (kolona3, zivopile0[3], zivopile1[3], zivopile2[3], zivopile3[3]);
  SlikaJajeNovo inst13 (.address(inst87_out), .clock(clock), .q(inst13_q));  // open: data, wren
  MP2X #(.size(12)) inst24 (.S(aktivanmetak), .X0(inst9_y), .X1(BojaMetka), .Y(inst24_y));
  CMPX #(.size(12)) inst23 (.A(12'b110000011000), .B(inst13_q), .eq(inst23_eq));  // open: ls, gr
  MP2X #(.size(8)) inst105 (.S(ZP), .X0({8{1'b1}}), .X1(ump), .Y(inst105_y));
  not inst49 (inst49_out, ZD);
  not inst50 (inst50_out, ZP);
  or inst125 (kolona5, zivopile0[5], zivopile1[5], zivopile2[5], zivopile3[5]);
  or inst126 (kolona4, zivopile0[4], zivopile1[4], zivopile2[4], zivopile3[4]);
  or inst128 (kolona2, zivopile0[2], zivopile1[2], zivopile2[2], zivopile3[2]);
  MP2X #(.size(8)) inst104 (.S(SW[7]), .X0({8{1'b1}}), .X1({8{1'b0}}), .Y(UJ0));
  MP2X #(.size(8)) inst106 (.S(SW[3]), .X0({8{1'b1}}), .X1({8{1'b0}}), .Y(UJ1));
  CMPX #(.size(12)) inst15 (.A(inst24_y), .B(12'b110100111001), .eq(inst15_eq));  // open: ls, gr
  and inst48 (Kraj, inst49_out, inst50_out);
  or inst136 (aktivanmetak, amps, amds);
  and inst118 (brzinaJaje1, SW[3], brzinaJajep);
  and inst117 (brzinaJaje0, SW[7], brzinaJajep);
  MP2X #(.size(8)) inst109 (.S(SW[6]), .X0({8{1'b1}}), .X1({8{1'b0}}), .Y(UJ2));
  MP2X #(.size(12)) inst26 (.S(inst23_eq), .X0(inst13_q), .X1(POZ), .Y(BojaJaje));
  Metkovi inst115 (
    .X(X), .Y(Y), .XMDefault(XMPK), .XVDefault(XVPK), .YMDefault(YMPK), .YVDefault(YVPK), .CLK(clock),
    .Brzina(brzinaMetka), .SmerKretanja(1'b1), .um(inst105_y), .Red(1'b1), .Pucam(keyPlus), .am0(amp[0]),
    .am1(amp[1]), .am2(amp[2]), .am3(amp[3]), .am4(amp[4]), .am5(amp[5]), .am6(amp[6]), .am7(amp[7]),
    .crtaj(amps), .ADDRMetka(ADDRMetkaP), .StateMetka(StateMetkaP));
  or inst129 (kolona1, zivopile0[1], zivopile1[1], zivopile2[1], zivopile3[1]);
  or inst130 (kolona0, zivopile0[0], zivopile1[0], zivopile2[0], zivopile3[0]);
  MP2X #(.size(8)) inst110 (.S(SW[2]), .X0({8{1'b1}}), .X1({8{1'b0}}), .Y(UJ3));
  MP2X #(.size(12)) inst10 (.S(inst15_eq), .X0(inst24_y), .X1(POZ), .Y(inst10_y));
  Binary2BCD inst64 (.binary_input(prvi), .bcd_units(prviu), .bcd_tens(prvit));
  and inst119 (brzinaJaje2, SW[6], brzinaJajep);
  MP2X #(.size(8)) inst111 (.S(SW[5]), .X0({8{1'b1}}), .X1({8{1'b0}}), .Y(UJ4));
  CONSTX #(.size(12), .\const (4)) inst1 (.data(POZ));
  CONSTX #(.size(12), .\const (2035)) inst12 (.data(PP));
  CONSTX #(.size(12), .\const (3356)) inst14 (.data(PD));
  CLK_DIVIDER #(.period_InMHz(50), .period_OutMiliSec(3)) inst32 (.in_clk(clock), .out_clk(inst32_out_clk));
  and inst120 (brzinaJaje3, SW[2], brzinaJajep);
  MP2X #(.size(12)) inst97 (.S(inst25_out), .X0(inst10_y), .X1(BojaIgraca), .Y(inst97_y));
  or inst25 (inst25_out, activeplayerp, activeplayerd);
  and inst121 (brzinaJaje4, SW[5], brzinaJajep);
  MP2X #(.size(8)) inst112 (.S(SW[1]), .X0({8{1'b1}}), .X1({8{1'b0}}), .Y(UJ5));
  MP2X #(.size(8)) inst107 (.S(ZD), .X0({8{1'b1}}), .X1(umd), .Y(inst107_y));
  or inst164 (inst164_out, ajs0, ajs1, ajs2, ajs3, ajs4, ajs5, ajs6, ajs7);
  and inst122 (brzinaJaje5, SW[1], brzinaJajep);
  RisingEdge inst37 (.CLK(clock), .IN(inst32_out_clk), .OUT(CLKK));
  or inst166 (inst166_out, ajs0, ajs1, ajs2, ajs3, ajs4, ajs5, ajs6, ajs7);
  MP2X #(.size(8)) inst113 (.S(SW[4]), .X0({8{1'b1}}), .X1({8{1'b0}}), .Y(UJ6));
  CONSTX #(.size(12), .\const (1234)) inst19 (.data(NRSN));
  CMPX #(.size(7)) inst51 (.A(prvi), .B(drugi), .ls(inst51_ls), .eq(inst51_eq), .gr(inst51_gr));
  Svi_Pilici inst153 (
    .X(X), .Y(Y), .amp(amp), .amd(amd), .CLK(clock), .ump(ump), .umd(umd), .BojaPileta(PILE),
    .apile(activepile), .zivopile0(zivopile0), .zivopile1(zivopile1), .zivopile2(zivopile2),
    .zivopile3(zivopile3), .crtajpile(crtajpile), .poenprvi(incPrvi), .poendrugi(incDrugi));
  and inst165 (led, inst164_out, activeplayerp);
  and inst143 (brzinaJaje6, SW[4], brzinaJajep);
  MP2X #(.size(12)) inst18 (.S(Kraj), .X0(inst97_y), .X1(BojaKraj), .Y(Boja));
  Metkovi inst148 (
    .X(X), .Y(Y), .XMDefault(XMDK), .XVDefault(XVDK), .YMDefault(YMDK), .YVDefault(YVDK), .CLK(clock),
    .Brzina(brzinaMetka), .SmerKretanja(1'b1), .um(inst107_y), .Red(1'b1), .Pucam(keyMinus), .am0(amd[0]),
    .am1(amd[1]), .am2(amd[2]), .am3(amd[3]), .am4(amd[4]), .am5(amd[5]), .am6(amd[6]), .am7(amd[7]),
    .crtaj(amds), .ADDRMetka(ADDRMetkaD), .StateMetka(StateMetkaD));
  Binary2BCD inst65 (
    .binary_input(drugi), .bcd_units({pin_name29, pin_name30, pin_name31, pin_name32}),
    .bcd_tens({pin_name33, pin_name34, pin_name35, pin_name36}));
  and inst167 (UmroDD, inst166_out, activeplayerd);
  MP2X #(.size(8)) inst114 (.S(SW[0]), .X0({8{1'b1}}), .X1({8{1'b0}}), .Y(UJ7));
  not inst133 (inst133_out, amps);
  assign inst52_out = PP & {12{inst51_gr}};  // AND2 inst52, 12 bits wide
  assign inst53_out = {12{inst51_eq}} & NRSN;  // AND2 inst53, 12 bits wide
  assign inst56_out = {12{inst51_ls}} & PD;  // AND2 inst56, 12 bits wide
  CONSTX #(.size(10), .\const (150)) inst149 (.data(inst149_data));
  CONSTX #(.size(10), .\const (172)) inst174 (.data(inst174_data));
  and inst145 (brzinaJaje7, SW[0], brzinaJajep);
  assign inst131_out = {9{amps}} & ADDRMetkaP;  // AND2 inst131, 9 bits wide
  assign inst132_out = {9{amds}} & {9{inst133_out}} & ADDRMetkaD;  // AND3 inst132, 9 bits wide
  CONSTX #(.size(10), .\const (470)) inst175 (.data(inst175_data));
  assign BojaKraj = inst52_out | inst53_out | inst56_out;  // OR3 inst54, 12 bits wide
  assign ADDRM = inst131_out | inst132_out;  // OR2 inst134, 9 bits wide
  not inst151 (inst151_out, amps);
  CONSTX #(.size(2), .\const (1)) inst155 (.data(inst155_data));
  CONSTX #(.size(10), .\const (450)) inst162 (.data(inst162_data));
  MP2X #(.size(1)) inst161 (.S(inst189_out), .X0(1'b1), .X1(1'b0), .Y(inst161_y));
  and inst189 (inst189_out, ZivBatak, inst188_out);
  assign inst147_out = {2{amps}} & StateMetkaP;  // AND2 inst147, 2 bits wide
  assign inst150_out = {2{amds}} & {2{inst151_out}} & StateMetkaD;  // AND3 inst150, 2 bits wide
  CMPX #(.size(2)) inst154 (.A(inst155_data), .B(StateMetka), .eq(jedan));  // open: ls, gr
  seven_segment_digit_interface inst77 (
    .x3(1'b0), .x2(zivotp[2]), .x1(zivotp[1]), .x0(zivotp[0]), .dot(1'b0), .en(1'b1), .a(pin_name1),
    .b(pin_name2), .c(pin_name3), .d(pin_name4), .e(pin_name5), .f(pin_name6), .g(pin_name7));  // open: dp
  seven_segment_digit_interface inst67 (
    .a(pin_name8), .b(pin_name9), .c(pin_name10), .d(pin_name11), .e(pin_name12), .f(pin_name13),
    .g(pin_name14));  // open: x3, x2, x1, x0, dot, en, dp
  seven_segment_digit_interface inst68 (
    .x3(prvit[3]), .x2(prvit[2]), .x1(prvit[1]), .x0(prvit[0]), .dot(1'b0), .en(1'b1), .a(pin_name15),
    .b(pin_name16), .c(pin_name17), .d(pin_name18), .e(pin_name19), .f(pin_name20), .g(pin_name21));  // open: dp
  seven_segment_digit_interface inst69 (
    .x3(prviu[3]), .x2(prviu[2]), .x1(prviu[1]), .x0(prviu[0]), .dot(1'b0), .en(1'b1), .a(pin_name22),
    .b(pin_name23), .c(pin_name24), .d(pin_name25), .e(pin_name26), .f(pin_name27), .g(pin_name28));  // open: dp
  not inst188 (inst188_out, inst187_out);
  SlikaMetak1 inst170 (.address(ADDRM), .clock(clock), .q(inst170_q));  // open: data, wren
  SlikaMetak2 inst171 (.address(ADDRM), .clock(clock), .q(inst171_q));  // open: data, wren
  SlikaMetak3 inst172 (.address(ADDRM), .clock(clock), .q(inst172_q));  // open: data, wren
  REGX #(.size(3), .default_value(0)) inst191 ();  // open: clk, ld, cl, inc, dec, data_in, data_out
  CLK_DIVIDER #(.period_InMHz(50), .period_OutMiliSec(10000)) inst99 (.in_clk(clock), .out_clk(inst99_out_clk));
  or inst187 (inst187_out, DodajD, DodajP);
  assign StateMetka = inst147_out | inst150_out;  // OR2 inst152, 2 bits wide
  Batak inst181 (
    .X(X), .Y(Y), .XMDefault(inst162_data), .XVDefault(inst175_data), .YMDefault(inst149_data),
    .YVDefault(inst174_data), .CLK(clock), .Brzina(CLKK), .SmerKretanja(1'b0), .Umri(inst161_y),
    .Restart(StvoriBatak), .Ziv(ZivBatak), .active(batak), .ADRMetka(inst181_adrmetka));  // open: State
  CMPX #(.size(3)) inst192 ();  // open: A, B, ls, eq, gr
  RisingEdge inst98 (.CLK(clock), .IN(inst99_out_clk), .OUT(StvoriBatak));
  assign inst163_out = inst170_q & {12{jedan}};  // AND2 inst163, 12 bits wide
  assign inst168_out = inst171_q & {12{dva}};  // AND2 inst168, 12 bits wide
  assign inst169_out = inst172_q & {12{\tri }};  // AND2 inst169, 12 bits wide
  and inst184 (DodajP, activeplayerp, batak);
  and inst185 (DodajD, activeplayerd, batak);
  CONSTX #(.size(2), .\const (2)) inst158 (.data(inst158_data));
  assign inst173_out = inst163_out | inst168_out | inst169_out;  // OR3 inst173, 12 bits wide
  CMPX #(.size(2)) inst157 (.A(inst158_data), .B(StateMetka), .eq(dva));  // open: ls, gr
  REGX #(.size(3), .default_value(0)) inst190 (
    .cl(inst193_eq), .data_in(undriven));  // open: clk, ld, inc, dec, data_out
  CMPX #(.size(12)) inst116 (.A(12'b111110001011), .B(inst173_out), .eq(inst116_eq));  // open: ls, gr
  MP2X #(.size(12)) inst108 (.S(inst116_eq), .X0(inst173_out), .X1(POZ), .Y(BojaMetka));
  CMPX #(.size(3)) inst193 (.A(undriven), .eq(inst193_eq));  // open: B, ls, gr
  SlikaJajeNovo inst178 (.address(inst181_adrmetka), .clock(clock), .q(inst178_q));  // open: data, wren
  CMPX #(.size(12)) inst176 (.A(12'b110000011000), .B(inst178_q), .eq(inst176_eq));  // open: ls, gr
  CONSTX #(.size(2), .\const (3)) inst160 (.data(inst160_data));
  CMPX #(.size(2)) inst159 (.A(inst160_data), .B(StateMetka), .eq(\tri ));  // open: ls, gr
  MP2X #(.size(12)) inst177 (.S(inst176_eq), .X0(12'b111100000000), .X1(POZ), .Y(BojaBatak));

  // Other names for the same wires on the sheet: CLK = clock;
  //   drugit[3:0] = {pin_name33, pin_name34, pin_name35, pin_name36}; drugit0 = pin_name36; drugit1 = pin_name35;
  //   drugit2 = pin_name34; drugit3 = pin_name33; drugiu[3:0] = {pin_name29, pin_name30, pin_name31, pin_name32};
  //   drugiu0 = pin_name32; drugiu1 = pin_name31; drugiu2 = pin_name30; drugiu3 = pin_name29; Jaje0 = SW[7];
  //   Jaje1 = SW[3]; Jaje2 = SW[6]; Jaje3 = SW[2]; Jaje4 = SW[5]; Jaje5 = SW[1]; Jaje6 = SW[4]; Jaje7 = SW[0];
  //   UmroPP = led; zivotd[2:0] = zivod

  // Notes on the sheet:
  //   ZivBatak
endmodule
